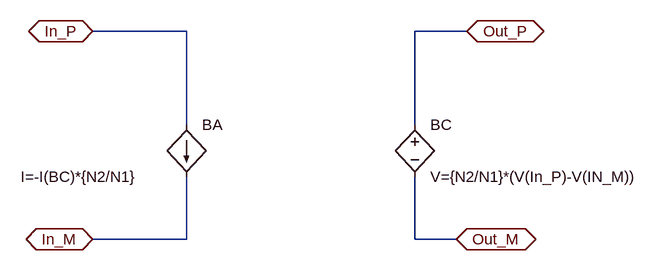
[diagram p0: schematic DC_Xfmr.asc]
DC_Xfmr.asc, the LTspice schematic file:
Version 4.1
SHEET 1 2180 2052
WIRE -48 -48 -192 -48
WIRE 384 -48 304 -48
WIRE -48 96 -48 -48
WIRE 304 96 304 -48
WIRE -48 272 -48 176
WIRE -48 272 -192 272
WIRE 304 272 304 176
WIRE 368 272 304 272
FLAG -192 -48 In_P
IOPIN -192 -48 BiDir
FLAG 368 272 Out_M
IOPIN 368 272 BiDir
FLAG 384 -48 Out_P
IOPIN 384 -48 BiDir
FLAG -192 272 In_M
IOPIN -192 272 BiDir
SYMBOL bv 304 80 R0
SYMATTR InstName BC
SYMATTR Value V={N2/N1}*(V(In_P)-V(IN_M))
SYMBOL bi -48 96 R0
WINDOW 3 -255 80 Left 2
SYMATTR Value I=-I(BC)*{N2/N1}
SYMATTR InstName BA

The netlist it stands for:
* DC_Xfmr.asc
BC Out_P Out_M V={N2/N1}*(V(In_P)-V(IN_M))
BA In_P In_M I=-I(BC)*{N2/N1}
.backanno
.end